# Altium schematic sheet Starboard_Deployable_Headers.SchDoc: Starboard_Deployable_Headers
size Letter; Author: Nicholas J. Sorensen, and Erik F. Halliwell; Engineer: Nicholas J. Sorensen, and Erik F. HalliwellNicholas Sorensen, and Erik Halliwell; DocumentNumber: 8; SheetNumber: 8; SheetTotal: 8
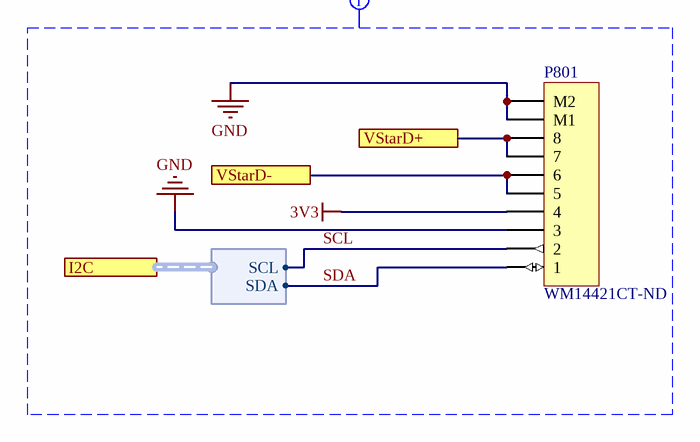
[diagram p0: Starboard_Deployable_Headers.SchDoc]

## Parts
P801  WM14421CT-ND  [MOLX-5040500891]

## Ports
I2C (harness I2C), VStarD+, VStarD-

## Harnesses
I2C: SCL, SDA

## Nets
3V3: P801.4
GND: P801.3 P801.M1 P801.M2
SCL: P801.2 ; port I2C.SCL
SDA: P801.1 ; port I2C.SDA
VStarD+: P801.7 P801.8 ; port VStarD+
VStarD-: P801.5 P801.6 ; port VStarD-

## Layout directives
mark named Starboard Deployable to Starboard: 3V3, GND, SCL, SDA

## Notes on the sheet
- (the "License"); you may not use or redistribute this file except in compliance with the License. You
- This file and the information within it are licensed under the terms of the Apache License, Version 2.0
- Copyright
- Unless required by applicable law or agreed to in writing, content distributed under the License is
- distributed on an "AS IS" BASIS, WITHOUT WARRANTIES OR CONDITIONS OF ANY KIND,
- either express or implied. See the License for the specific language governing permissions and
- limitations under the License.
- may obtain a copy of the License at:
- http://www.apache.org/licenses/LICENSE-2.0
- Title
- Size:
- Date:
- Letter
- Number:
- Time:
- Revision:
- Sheet
- of
- University of Alberta
- Deptartment of Electrical
- and Computer Engineering
- Edmonton AB, Canada
- T6G 1H9
- File:

## Library data of the parts
P801 = 67: CONN HEADER SMD R/A 8POS 1.5MM; Part Number: 67; Manufacturer Part Number: 5040500891; Designator: P?; LatestRevisionDate: 17-Jul-2002; LatestRevisionNote: Re-released for DXP Platform.; Publisher: Altium Limited; Supplier Part Number 1: WM14421CT-ND; Supplier 1: Digi-Key; Supplier Link: #https://www.digikey.ca/product-detail/en/molex/5040500891/WM14421CT-ND/6133151#